# Altium project IR_Sensor.PrjPcb
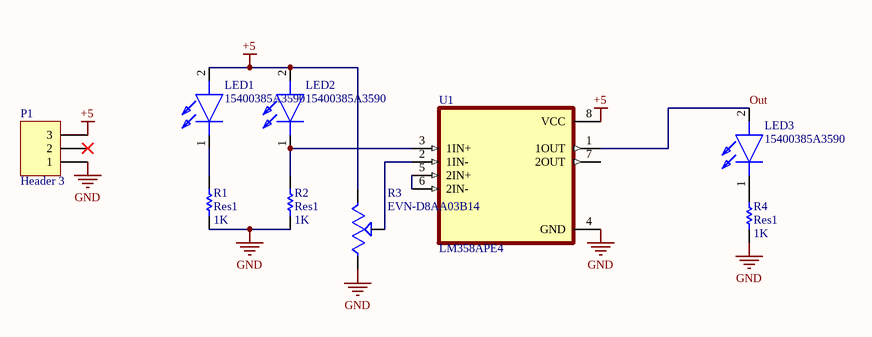
[diagram p0: Sheet1.SchDoc]
1 sheet, 9 parts. Net scope: global (net labels, ports and power ports of the same name join across sheets).
Board file: PCB1.PcbDoc

## Sheet Sheet1.SchDoc
size A4; SheetNumber: 1; SheetTotal: 1

### Parts
LED1  15400385A3590  [15400385A3590]
LED2  15400385A3590  [15400385A3590]
LED3  15400385A3590  [15400385A3590]
P1  Header 3  [HDR1X3]
R1  Res1  value 1K  [AXIAL-0.3]
R2  Res1  value 1K  [AXIAL-0.3]
R3  EVN-D8AA03B14  [TRIM_EVN-D8AA03B14]
R4  Res1  value 1K  [AXIAL-0.3]
U1  LM358APE4  [DIP794W45P254L959H508Q8]

### Nets
+5: LED1.2(A) LED2.2(A) P1.3 R3.3 U1.8(VCC)
GND: P1.1 R1.1 R2.1 R3.1 R4.1 U1.4(GND)
Out: LED3.2(A) U1.1(1OUT)
NetLED1_1: LED1.1(K) R1.2
NetLED2_1: LED2.1(K) R2.2 U1.3(1IN+)
NetLED3_1: LED3.1(K) R4.2
NetR3_2: R3.2 U1.2(1IN-)
NetU1_5: U1.5(2IN+) U1.6(2IN-)

Not connected (* = marked no-connect by the designer): P1 2*; U1 7(2OUT)

### Library data of the parts
LED1-LED3 = 15400385A3590: LED; Manufacturer_Name: Wurth Elektronik; Datasheet Link: https://www.we-online.com/katalog/datasheet/15400385A3590.pdf; Height: 10.9mm; Manufacturer_Part_Number: 15400385A3590; Mouser Part Number: 710-15400385A3590; Mouser Price/Stock: https://www.mouser.co.uk/ProductDetail/Wurth-Elektronik/15400385A3590?qs=5aG0NVq1C4yszs1ddn0oOg%3D%3D
P1 = Header 3: Header, 3-Pin; LatestRevisionDate: 17-Jul-2002; LatestRevisionNote: Re-released for DXP Platform.; Publisher: Altium Limited
R1 R2 R4 = Res1: Resistor; Published: 8-Jun-2000; LatestRevisionDate: 17-Jul-2002; LatestRevisionNote: Re-released for DXP Platform.; PackageReference: AXIAL-0.3; Publisher: Altium Limited; PackageDescription: Axial Device, Thru-Hole; 2 Leads; 0.3 in Pin Spacing
R3 = EVN-D8AA03B14: 10 kOhms 0.1W, 1/10W PC Pins Through Hole Trimmer Potentiometer Carbon 1.0 Turn Top Adjustment; MF: Panasonic Electronic; SnapEDA_Link: https://www.snapeda.com/parts/EVN-D8AA03B14/Panasonic+Electronic+Components/view-part/?ref=snap; Package: PQFP-44 Panasonic; MP: EVN-D8AA03B14; Check_prices: https://www.snapeda.com/parts/EVN-D8AA03B14/Panasonic+Electronic+Components/view-part/?ref=eda; Purchase-URL: https://pricing.snapeda.com/search/part/EVN-D8AA03B14/?ref=eda; Price: None; Value: *; Availability: In Stock
U1 = LM358APE4: Dual, 30-V, 700-kHz operational amplifier; MF: Texas Instruments; Check_prices: https://www.snapeda.com/parts/LM358APE4/Texas+Instruments/view-part/?ref=eda; Value: *; Availability: In Stock; MP: LM358APE4; Price: None; Package: PDIP-8 Texas; SnapEDA_Link: https://www.snapeda.com/parts/LM358APE4/Texas+Instruments/view-part/?ref=snap; Purchase-URL: https://pricing.snapeda.com/search/part/LM358APE4/?ref=eda